# Altium schematic sheet STM32F429.SchDoc
size A2 portrait
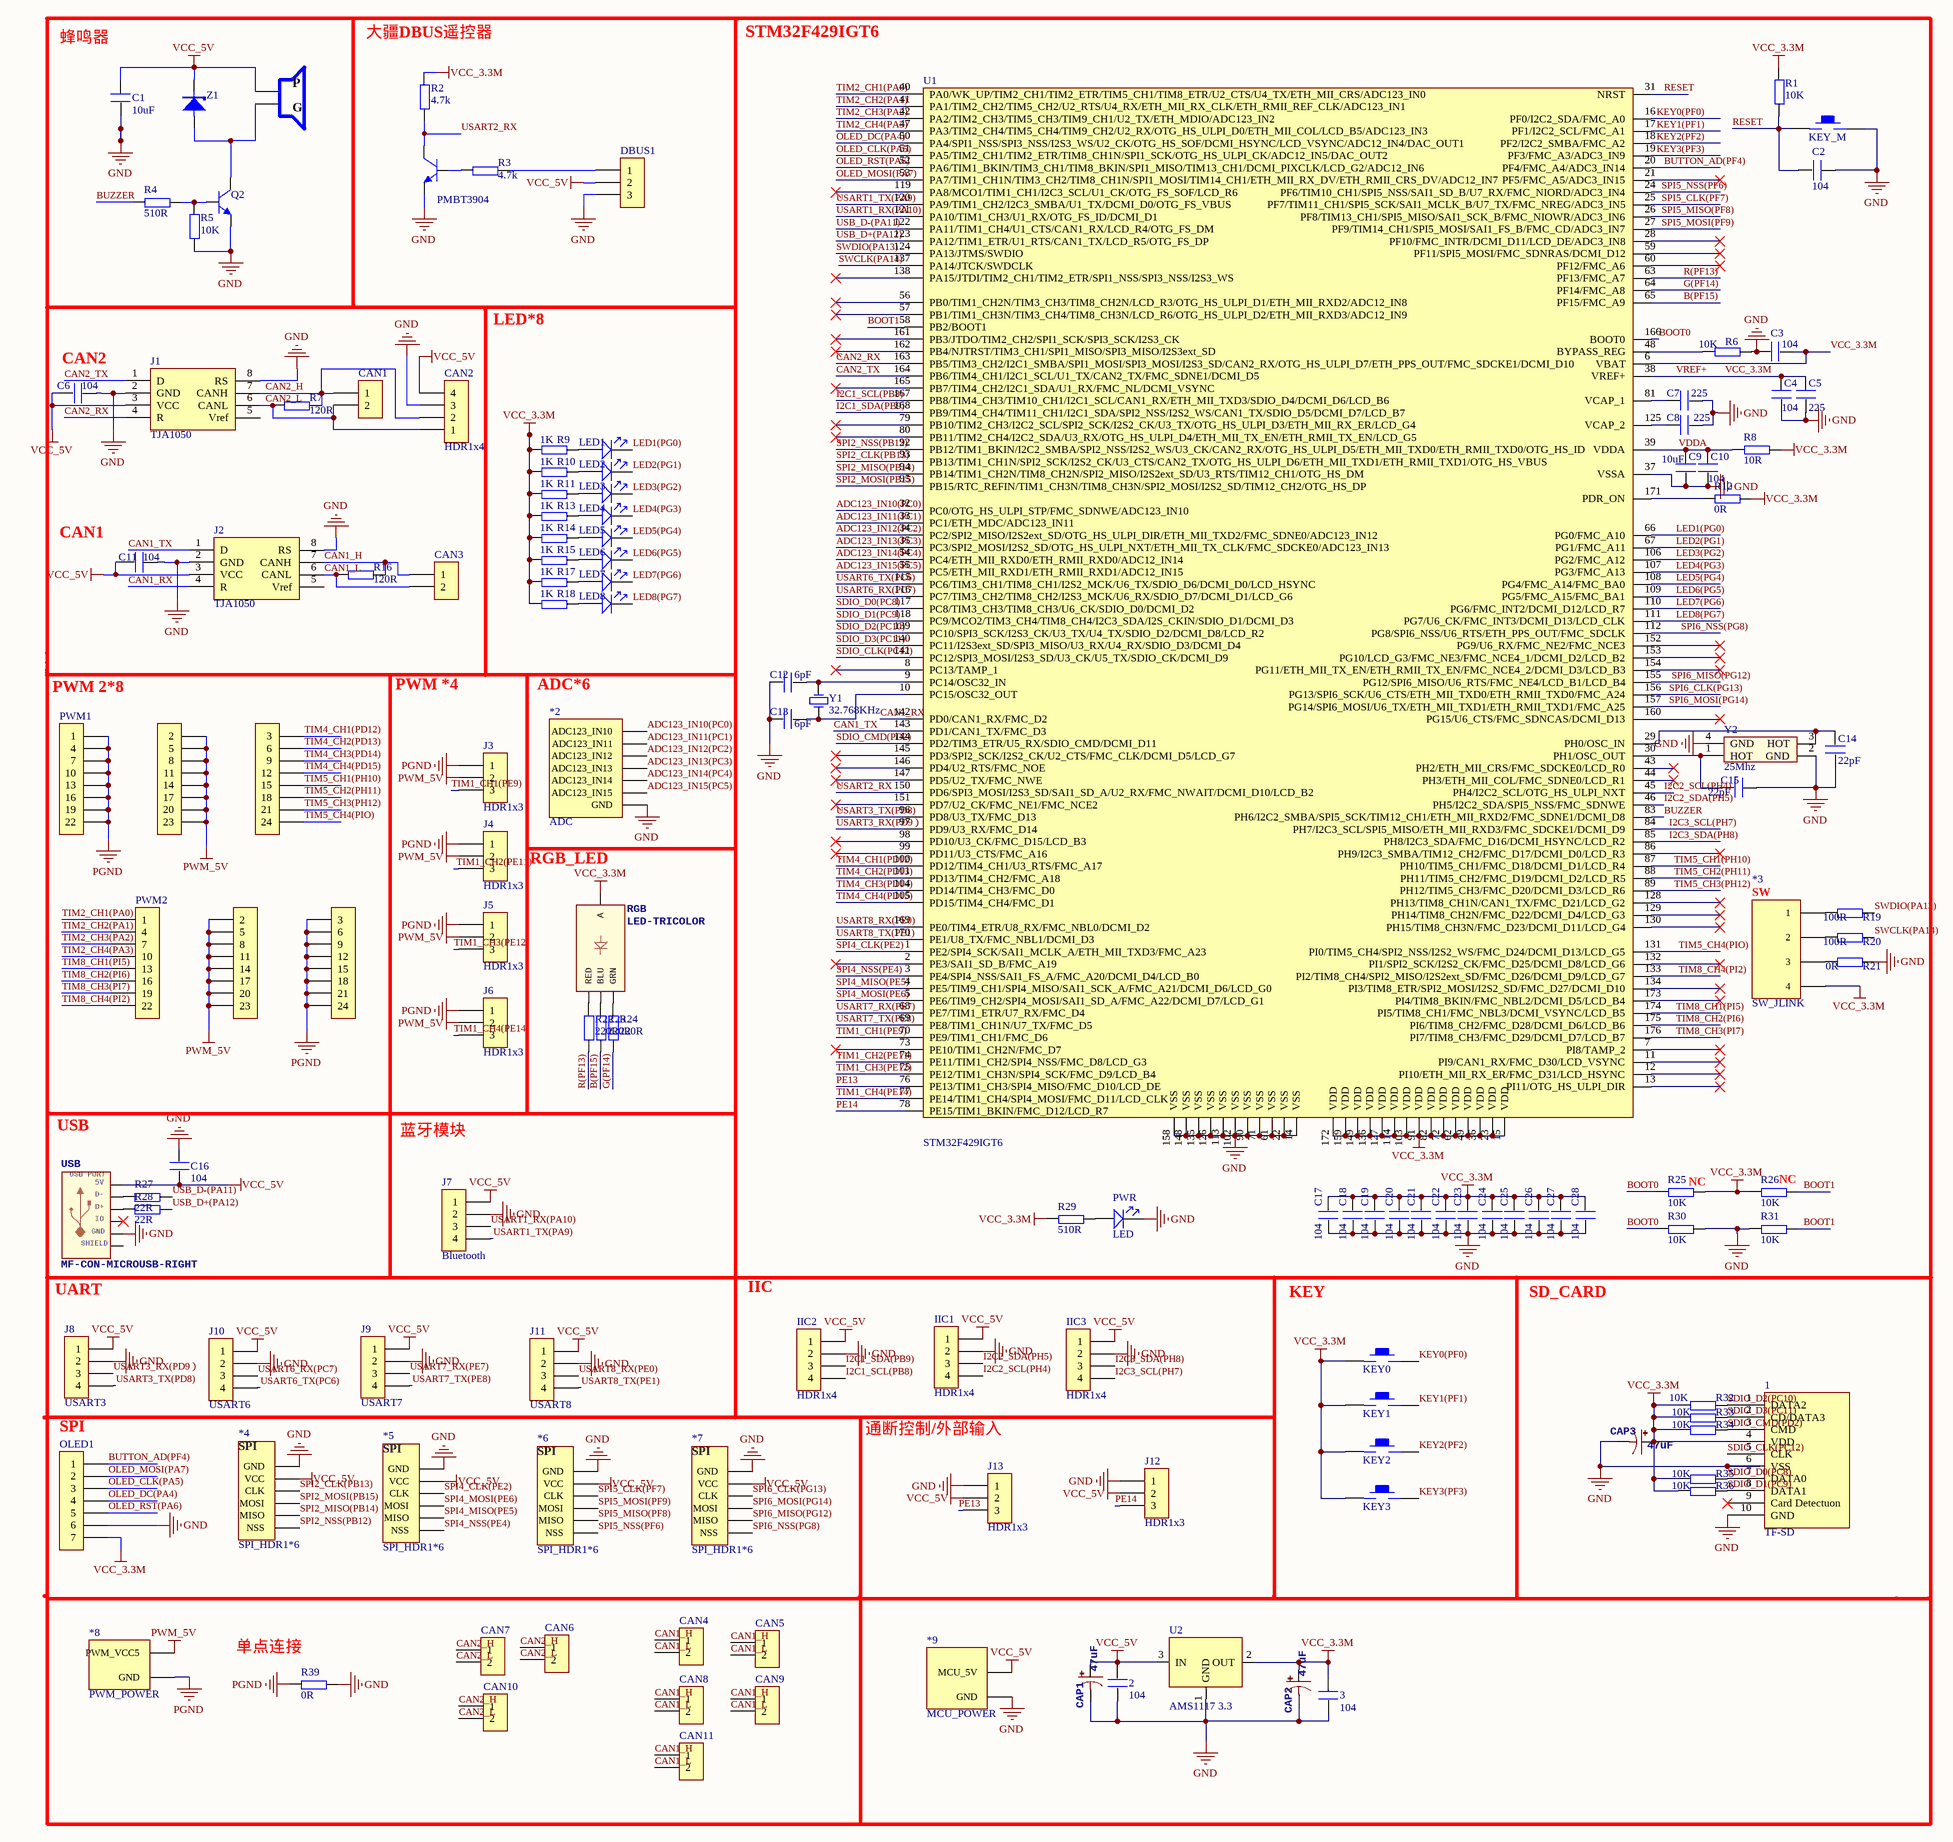
[diagram p0: STM32F429.SchDoc]

## Parts
1  TF-SD  [TF]
2  104  [0603P]
3  104  [0603P]
*1  BUZZER  [BUZZER]  (value not drawn)
*2  ADC  [ADC]
*3  SW_JLINK  [GH1.25-立贴-4P]
*4  SPI_HDR1*6  [GH1.25-立贴-6P]
*5  SPI_HDR1*6  [GH1.25-立贴-6P]
*6  SPI_HDR1*6  [GH1.25-立贴-6P]
*7  SPI_HDR1*6  [GH1.25-立贴-6P]
*8  PWM_POWER  [XT30_PW母头]
*9  MCU_POWER  [XT30_PW母头]
C1  10uF  [0603P]
C2  104  [0603P]
C3  104  [0603P]
C4  104  [0603P]
C5  225  [0603P]
C6  104  [0603P]
C7  225  [0603P]
C8  225  [0603P]
C9  10uF  [0603P]
C10  104  [0603P]
C11  104  [0603P]
C12  6pF  [0603P]
C13  6pF  [0603P]
C14  22pF  [0603P]
C15  22pF  [0603P]
C16  104  [0603P]
C17  104  [0603P]
C18  104  [0603P]
C19  104  [0603P]
C20  104  [0603P]
C21  104  [0603P]
C22  104  [0603P]
C23  104  [0603P]
C24  104  [0603P]
C25  104  [0603P]
C26  104  [0603P]
C27  104  [0603P]
C28  104  [0603P]
CAN1  HDR1x2-right  [GH1.25-立贴-2P]  (value not drawn)
CAN2  HDR1x4  [GH1.25-立贴-4P]
CAN3  HDR1x2-right  [GH1.25-立贴-2P]  (value not drawn)
CAN4  HDR1x2-right  [GH1.25-立贴-2P]  (value not drawn)
CAN5  HDR1x2-right  [GH1.25-立贴-2P]  (value not drawn)
CAN6  HDR1x2-right  [GH1.25-立贴-2P]  (value not drawn)
CAN7  HDR1x2-right  [GH1.25-立贴-2P]  (value not drawn)
CAN8  HDR1x2-right  [GH1.25-立贴-2P]  (value not drawn)
CAN9  HDR1x2-right  [GH1.25-立贴-2P]  (value not drawn)
CAN10  HDR1x2-right  [GH1.25-立贴-2P]  (value not drawn)
CAN11  HDR1x2-right  [GH1.25-立贴-2P]  (value not drawn)
CAP1  47uF  [EIA3216]
CAP2  47uF  [EIA3216]
CAP3  47uF  [EIA3216]
DBUS1  HDR1x3-right  [PIN-1*3-2.54]  (value not drawn)
IIC1  HDR1x4  [GH1.25-立贴-4P]
IIC2  HDR1x4  [GH1.25-立贴-4P]
IIC3  HDR1x4  [GH1.25-立贴-4P]
J1  TJA1050  [SOIC-8_150mil]
J2  TJA1050  [SOIC-8_150mil]
J3  HDR1x3  [HDR1X3]
J4  HDR1x3  [HDR1X3]
J5  HDR1x3  [HDR1X3]
J6  HDR1x3  [HDR1X3]
J7  Bluetooth  [1X04]
J8  USART3  [GH1.25-立贴-4P]
J9  USART7  [GH1.25-立贴-4P]
J10  USART6  [GH1.25-立贴-4P]
J11  USART8  [GH1.25-立贴-4P]
J12  HDR1x3  [HDR1X3]
J13  HDR1x3  [HDR1X3]
KEY1  KEY0  [KEY_SOP324225]
KEY2  KEY1  [KEY_SOP324225]
KEY3  KEY2  [KEY_SOP324225]
KEY4  KEY3  [KEY_SOP324225]
LED1  LED  [0805 LED]  (value not drawn)
LED2  LED  [0805 LED]  (value not drawn)
LED3  LED  [0805 LED]  (value not drawn)
LED4  LED  [0805 LED]  (value not drawn)
LED5  LED  [0805 LED]  (value not drawn)
LED6  LED  [0805 LED]  (value not drawn)
LED7  LED  [0805 LED]  (value not drawn)
LED8  LED  [0805 LED]  (value not drawn)
OLED1  HDR1x7-left  [GH1.25-立贴-7P]  (value not drawn)
PWM1  HDR3*8-right  [PIN-3*8-2.54 - duplicate]  (value not drawn)
PWM2  HDR3*8-left  [PIN-3*8-2.54 - duplicate]  (value not drawn)
PWR  LED  [0805 LED]
Q1  PMBT3904  [SOT-23-3]
Q2  S8050  [SOT-23-3]  (value not drawn)
R1  10K  [0603P]
R2  4.7k  [0603P]
R3  4.7k  [0603P]
R4  510R  [0603P]
R5  10K  [0603P]
R6  10K  [0603P]
R7  120R  [0603P]
R8  10R  [0603P]
R9  1K  [0603P]
R10  1K  [0603P]
R11  1K  [0603P]
R12  0R  [0603P]
R13  1K  [0603P]
R14  1K  [0603P]
R15  1K  [0603P]
R16  120R  [0603P]
R17  1K  [0603P]
R18  1K  [0603P]
R19  100R  [0603P]
R20  100R  [0603P]
R21  0R  [0603P]
R22  220R  [0603P]
R23  220R  [0603P]
R24  220R  [0603P]
R25  10K  [0603P]
R26  10K  [0603P]
R27  22R  [0603P]
R28  22R  [0603P]
R29  510R  [0603P]
R30  10K  [0603P]
R31  10K  [0603P]
R32  10K  [0603P]
R33  10K  [0603P]
R34  10K  [0603P]
R35  10K  [0603P]
R36  10K  [0603P]
R39  0R  [0805]
RGB  LED-TRICOLOR  [rgb]
RST1  KEY_M  [KEY_SOP324225]
U1  STM32F429IGT6  [LQFP176]
U2  AMS1117 3.3  [SOT_223]
USB  MF-CON-MICROUSB-RIGHT  USBPORT: USB PORT  [micro_usb]
Y1  32.768KHz  [XTAL3215]
Y2  25Mhz  [XTAL3225]
Z1  MMSZ4684  [SOD-123]  (value not drawn)

## Nets
GND: 1.6(VSS) 1.10(GND) 2.1 3.1 *2.6(GND) *4.1(GND) *5.1(GND) *6.1(GND) *7.1(GND) *9.2(GND) C1.1 C2.1 C3.1 C4.1 C5.1 C6.1 C7.2 C8.2 C9.1 C10.1 C11.1 C12.1 C13.1 C14.1 C15.1 C16.2 C17.1 C18.1 C19.1 C20.1 C21.1 C22.1 C23.1 C24.1 C25.1 C26.1 C27.1 C28.1 CAN2.3 CAP1.C(-) CAP2.C(-) CAP3.C(-) DBUS1.3 IIC1.2 IIC2.2 IIC3.2 J1.2(GND) J1.8(RS) J2.2(GND) J2.8(RS) J7.2 J8.2 J9.2 J10.2 J11.2 J12.1 J13.1 OLED1.6 PWR.2 Q1.2(E) Q2.2(E) R5.1 R6.2 R21.2 R30.2 R31.1 R39.2 RST1.2 U1.14(VSS) U1.22(VSS) U1.37(VSSA) U1.61(VSS) U1.71(VSS) U1.90(VSS) U1.102(VSS) U1.113(VSS) U1.126(VSS) U1.135(VSS) U1.148(VSS) U1.158(VSS) U2.1(GND) USB.5(GND) Y2.2(GND) Y2.4(GND)
PGND: *8.2(GND) J3.1 J4.1 J5.1 J6.1 PWM1.1 PWM1.4 PWM1.7 PWM1.10 PWM1.13 PWM1.16 PWM1.19 PWM1.22 PWM2.3 PWM2.6 PWM2.9 PWM2.12 PWM2.15 PWM2.18 PWM2.21 PWM2.24 R39.1
PWM_5V: *8.1(PWM_VCC5) J3.2 J4.2 J5.2 J6.2 PWM1.2 PWM1.5 PWM1.8 PWM1.11 PWM1.14 PWM1.17 PWM1.20 PWM1.23 PWM2.2 PWM2.5 PWM2.8 PWM2.11 PWM2.14 PWM2.17 PWM2.20 PWM2.23
VCC_3.3M: 1.4(VDD) 3.2 *3.4 C3.2 C4.2 C5.2 C17.2 C18.2 C19.2 C20.2 C21.2 C22.2 C23.2 C24.2 C25.2 C26.2 C27.2 C28.2 CAP2.A(+) CAP3.A(+) KEY1.1 KEY2.1 KEY3.1 KEY4.1 OLED1.7 R1.2 R2.2 R8.2 R9.1 R10.1 R11.1 R12.2 R13.1 R14.1 R15.1 R17.1 R18.1 R25.2 R26.1 R29.1 R32.1 R33.1 R34.1 R35.1 R36.1 RGB.A U1.6(VBAT) U1.15(VDD) U1.23(VDD) U1.36(VDD) U1.38(VREF+) U1.49(VDD) U1.62(VDD) U1.72(VDD) U1.82(VDD) U1.91(VDD) U1.103(VDD) U1.114(VDD) U1.127(VDD) U1.136(VDD) U1.149(VDD) U1.159(VDD) U1.172(VDD) U2.2(OUT)  [also labelled VREF+]
VCC_5V: 2.2 *1.1 *4.2(VCC) *5.2(VCC) *6.2(VCC) *7.2(VCC) *9.1(MCU_5V) C1.2 C6.2 C11.2 C16.1 CAN2.4 CAP1.A(+) DBUS1.2 IIC1.1 IIC2.1 IIC3.1 J1.3(VCC) J2.3(VCC) J7.1 J8.1 J9.1 J10.1 J11.1 J12.2 J13.2 U2.3(IN) USB.1(5V) Z1.2(C)
ADC123_IN10(PC0): *2.0(ADC123_IN10) U1.32(PC0/OTG_HS_ULPI_STP/FMC_SDNWE/ADC123_IN10)
ADC123_IN11(PC1): *2.1(ADC123_IN11) U1.33(PC1/ETH_MDC/ADC123_IN11)
ADC123_IN12(PC2): *2.2(ADC123_IN12) U1.34(PC2/SPI2_MISO/I2S2ext_SD/OTG_HS_ULPI_DIR/ETH_MII_TXD2/FMC_SDNE0/ADC123_IN12)
ADC123_IN13(PC3): *2.3(ADC123_IN13) U1.35(PC3/SPI2_MOSI/I2S2_SD/OTG_HS_ULPI_NXT/ETH_MII_TX_CLK/FMC_SDCKE0/ADC123_IN13)
ADC123_IN14(PC4): *2.4(ADC123_IN14) U1.54(PC4/ETH_MII_RXD0/ETH_RMII_RXD0/ADC12_IN14)
ADC123_IN15(PC5): *2.5(ADC123_IN15) U1.55(PC5/ETH_MII_RXD1/ETH_RMII_RXD1/ADC12_IN15)
B(PF15): R23.1 U1.65(PF15/FMC_A9)
BOOT0: R25.1 R30.1 U1.166(BOOT0)
BOOT1: R26.2 R31.2 U1.58(PB2/BOOT1)
BUTTON_AD(PF4): OLED1.1 U1.20(PF4/FMC_A4/ADC3_IN14)
BUZZER: R4.1 U1.83(PH6/I2C2_SMBA/SPI5_SCK/TIM12_CH1/ETH_MII_RXD2/FMC_SDNE1/DCMI_D8)
CAN1_H: CAN3.1 CAN4.1 CAN5.1 CAN8.1 CAN9.1 CAN11.1 J2.7(CANH) R16.2
CAN1_L: CAN3.2 CAN4.2 CAN5.2 CAN8.2 CAN9.2 CAN11.2 J2.6(CANL) R16.1
CAN1_RX: J2.4(R) U1.142(PD0/CAN1_RX/FMC_D2)
CAN1_TX: J2.1(D) U1.143(PD1/CAN1_TX/FMC_D3)
CAN2_H: CAN1.1 CAN2.2 CAN6.1 CAN7.1 CAN10.1 J1.7(CANH) R7.2
CAN2_L: CAN1.2 CAN2.1 CAN6.2 CAN7.2 CAN10.2 J1.6(CANL) R7.1
CAN2_RX: J1.4(R) U1.163(PB5/TIM3_CH2/I2C1_SMBA/SPI1_MOSI/SPI3_MOSI/I2S3_SD/CAN2_RX/OTG_HS_ULPI_D7/ETH_PPS_OUT/FMC_SDCKE1/DCMI_D10)
CAN2_TX: J1.1(D) U1.164(PB6/TIM4_CH1/I2C1_SCL/U1_TX/CAN2_TX/FMC_SDNE1/DCMI_D5)
G(PF14): R24.1 U1.64(PF14/FMC_A8)
I2C1_SCL(PB8): IIC2.4 U1.167(PB8/TIM4_CH3/TIM10_CH1/I2C1_SCL/CAN1_RX/ETH_MII_TXD3/SDIO_D4/DCMI_D6/LCD_B6)
I2C1_SDA(PB9): IIC2.3 U1.168(PB9/TIM4_CH4/TIM11_CH1/I2C1_SDA/SPI2_NSS/I2S2_WS/CAN1_TX/SDIO_D5/DCMI_D7/LCD_B7)
I2C2_SCL(PH4): IIC1.4 U1.45(PH4/I2C2_SCL/OTG_HS_ULPI_NXT)
I2C2_SDA(PH5): IIC1.3 U1.46(PH5/I2C2_SDA/SPI5_NSS/FMC_SDNWE)
I2C3_SCL(PH7): IIC3.4 U1.84(PH7/I2C3_SCL/SPI5_MISO/ETH_MII_RXD3/FMC_SDCKE1/DCMI_D9)
I2C3_SDA(PH8): IIC3.3 U1.85(PH8/I2C3_SDA/FMC_D16/DCMI_HSYNC/LCD_R2)
KEY0(PF0): KEY1.2 U1.16(PF0/I2C2_SDA/FMC_A0)
KEY1(PF1): KEY2.2 U1.17(PF1/I2C2_SCL/FMC_A1)
KEY2(PF2): KEY3.2 U1.18(PF2/I2C2_SMBA/FMC_A2)
KEY3(PF3): KEY4.2 U1.19(PF3/FMC_A3/ADC3_IN9)
LED1(PG0): LED1.2 U1.66(PG0/FMC_A10)
LED2(PG1): LED2.2 U1.67(PG1/FMC_A11)
LED3(PG2): LED3.2 U1.106(PG2/FMC_A12)
LED4(PG3): LED4.2 U1.107(PG3/FMC_A13)
LED5(PG4): LED5.2 U1.108(PG4/FMC_A14/FMC_BA0)
LED6(PG5): LED6.2 U1.109(PG5/FMC_A15/FMC_BA1)
LED7(PG6): LED7.2 U1.110(PG6/FMC_INT2/DCMI_D12/LCD_R7)
LED8(PG7): LED8.2 U1.111(PG7/U6_CK/FMC_INT3/DCMI_D13/LCD_CLK)
OLED_CLK(PA5): OLED1.3 U1.51(PA5/TIM2_CH1/TIM2_ETR/TIM8_CH1N/SPI1_SCK/OTG_HS_ULPI_CK/ADC12_IN5/DAC_OUT2)
OLED_DC(PA4): OLED1.4 U1.50(PA4/SPI1_NSS/SPI3_NSS/I2S3_WS/U2_CK/OTG_HS_SOF/DCMI_HSYNC/LCD_VSYNC/ADC12_IN4/DAC_OUT1)
OLED_MOSI(PA7): OLED1.2 U1.53(PA7/TIM1_CH1N/TIM3_CH2/TIM8_CH1N/SPI1_MOSI/TIM14_CH1/ETH_MII_RX_DV/ETH_RMII_CRS_DV/ADC12_IN7)
OLED_RST(PA6): OLED1.5 U1.52(PA6/TIM1_BKIN/TIM3_CH1/TIM8_BKIN/SPI1_MISO/TIM13_CH1/DCMI_PIXCLK/LCD_G2/ADC12_IN6)
PE13: J13.3 U1.76(PE13/TIM1_CH3/SPI4_MISO/FMC_D10/LCD_DE)
PE14: J12.3 U1.78(PE15/TIM1_BKIN/FMC_D12/LCD_R7)
R(PF13): R22.1 U1.63(PF13/FMC_A7)
RESET: C2.2 R1.1 RST1.1 U1.31(NRST)
SDIO_CLK(PC12): 1.5(CLK) U1.141(PC12/SPI3_MOSI/I2S3_SD/U3_CK/U5_TX/SDIO_CK/DCMI_D9)
SDIO_CMD(PD2): 1.3(CMD) R34.2 U1.144(PD2/TIM3_ETR/U5_RX/SDIO_CMD/DCMI_D11)
SDIO_D0(PC8): 1.7(DATA0) R35.2 U1.117(PC8/TIM3_CH3/TIM8_CH3/U6_CK/SDIO_D0/DCMI_D2)
SDIO_D1(PC9): 1.8(DATA1) R36.2 U1.118(PC9/MCO2/TIM3_CH4/TIM8_CH4/I2C3_SDA/I2S_CKIN/SDIO_D1/DCMI_D3)
SDIO_D2(PC10): 1.1(DATA2) R32.2 U1.139(PC10/SPI3_SCK/I2S3_CK/U3_TX/U4_TX/SDIO_D2/DCMI_D8/LCD_R2)
SDIO_D3(PC11): 1.2(CD/DATA3) R33.2 U1.140(PC11/I2S3ext_SD/SPI3_MISO/U3_RX/U4_RX/SDIO_D3/DCMI_D4)
SPI2_CLK(PB13): *4.3(CLK) U1.93(PB13/TIM1_CH1N/SPI2_SCK/I2S2_CK/U3_CTS/CAN2_TX/OTG_HS_ULPI_D6/ETH_MII_TXD1/ETH_RMII_TXD1/OTG_HS_VBUS)
SPI2_MISO(PB14): *4.5(MISO) U1.94(PB14/TIM1_CH2N/TIM8_CH2N/SPI2_MISO/I2S2ext_SD/U3_RTS/TIM12_CH1/OTG_HS_DM)
SPI2_MOSI(PB15): *4.4(MOSI) U1.95(PB15/RTC_REFIN/TIM1_CH3N/TIM8_CH3N/SPI2_MOSI/I2S2_SD/TIM12_CH2/OTG_HS_DP)
SPI2_NSS(PB12): *4.6(NSS) U1.92(PB12/TIM1_BKIN/I2C2_SMBA/SPI2_NSS/I2S2_WS/U3_CK/CAN2_RX/OTG_HS_ULPI_D5/ETH_MII_TXD0/ETH_RMII_TXD0/OTG_HS_ID)
SPI4_CLK(PE2): *5.3(CLK) U1.1(PE2/SPI4_SCK/SAI1_MCLK_A/ETH_MII_TXD3/FMC_A23)
SPI4_MISO(PE5): *5.5(MISO) U1.4(PE5/TIM9_CH1/SPI4_MISO/SAI1_SCK_A/FMC_A21/DCMI_D6/LCD_G0)
SPI4_MOSI(PE6): *5.4(MOSI) U1.5(PE6/TIM9_CH2/SPI4_MOSI/SAI1_SD_A/FMC_A22/DCMI_D7/LCD_G1)
SPI4_NSS(PE4): *5.6(NSS) U1.3(PE4/SPI4_NSS/SAI1_FS_A/FMC_A20/DCMI_D4/LCD_B0)
SPI5_CLK(PF7): *6.3(CLK) U1.25(PF7/TIM11_CH1/SPI5_SCK/SAI1_MCLK_B/U7_TX/FMC_NREG/ADC3_IN5)
SPI5_MISO(PF8): *6.5(MISO) U1.26(PF8/TIM13_CH1/SPI5_MISO/SAI1_SCK_B/FMC_NIOWR/ADC3_IN6)
SPI5_MOSI(PF9): *6.4(MOSI) U1.27(PF9/TIM14_CH1/SPI5_MOSI/SAI1_FS_B/FMC_CD/ADC3_IN7)
SPI5_NSS(PF6): *6.6(NSS) U1.24(PF6/TIM10_CH1/SPI5_NSS/SAI1_SD_B/U7_RX/FMC_NIORD/ADC3_IN4)
SPI6_CLK(PG13): *7.3(CLK) U1.156(PG13/SPI6_SCK/U6_CTS/ETH_MII_TXD0/ETH_RMII_TXD0/FMC_A24)
SPI6_MISO(PG12): *7.5(MISO) U1.155(PG12/SPI6_MISO/U6_RTS/FMC_NE4/LCD_B1/LCD_B4)
SPI6_MOSI(PG14): *7.4(MOSI) U1.157(PG14/SPI6_MOSI/U6_TX/ETH_MII_TXD1/ETH_RMII_TXD1/FMC_A25)
SPI6_NSS(PG8): *7.6(NSS) U1.112(PG8/SPI6_NSS/U6_RTS/ETH_PPS_OUT/FMC_SDCLK)
SWCLK(PA14): R20.2 U1.137(PA14/JTCK/SWDCLK)
SWDIO(PA13): R19.2 U1.124(PA13/JTMS/SWDIO)
TIM1_CH1(PE9): J3.3 U1.70(PE9/TIM1_CH1/FMC_D6)
TIM1_CH2(PE11): J4.3 U1.74(PE11/TIM1_CH2/SPI4_NSS/FMC_D8/LCD_G3)
TIM1_CH3(PE12): J5.3 U1.75(PE12/TIM1_CH3N/SPI4_SCK/FMC_D9/LCD_B4)
TIM1_CH4(PE14): J6.3 U1.77(PE14/TIM1_CH4/SPI4_MOSI/FMC_D11/LCD_CLK)
TIM2_CH1(PA0): PWM2.1 U1.40(PA0/WK_UP/TIM2_CH1/TIM2_ETR/TIM5_CH1/TIM8_ETR/U2_CTS/U4_TX/ETH_MII_CRS/ADC123_IN0)
TIM2_CH2(PA1): PWM2.4 U1.41(PA1/TIM2_CH2/TIM5_CH2/U2_RTS/U4_RX/ETH_MII_RX_CLK/ETH_RMII_REF_CLK/ADC123_IN1)
TIM2_CH3(PA2): PWM2.7 U1.42(PA2/TIM2_CH3/TIM5_CH3/TIM9_CH1/U2_TX/ETH_MDIO/ADC123_IN2)
TIM2_CH4(PA3): PWM2.10 U1.47(PA3/TIM2_CH4/TIM5_CH4/TIM9_CH2/U2_RX/OTG_HS_ULPI_D0/ETH_MII_COL/LCD_B5/ADC123_IN3)
TIM4_CH1(PD12): PWM1.3 U1.100(PD12/TIM4_CH1/U3_RTS/FMC_A17)
TIM4_CH2(PD13): PWM1.6 U1.101(PD13/TIM4_CH2/FMC_A18)
TIM4_CH3(PD14): PWM1.9 U1.104(PD14/TIM4_CH3/FMC_D0)
TIM4_CH4(PD15): PWM1.12 U1.105(PD15/TIM4_CH4/FMC_D1)
TIM5_CH1(PH10): PWM1.15 U1.87(PH10/TIM5_CH1/FMC_D18/DCMI_D1/LCD_R4)
TIM5_CH2(PH11): PWM1.18 U1.88(PH11/TIM5_CH2/FMC_D19/DCMI_D2/LCD_R5)
TIM5_CH3(PH12): PWM1.21 U1.89(PH12/TIM5_CH3/FMC_D20/DCMI_D3/LCD_R6)
TIM5_CH4(PIO): PWM1.24 U1.131(PI0/TIM5_CH4/SPI2_NSS/I2S2_WS/FMC_D24/DCMI_D13/LCD_G5)
TIM8_CH1(PI5): PWM2.13 U1.174(PI5/TIM8_CH1/FMC_NBL3/DCMI_VSYNC/LCD_B5)
TIM8_CH2(PI6): PWM2.16 U1.175(PI6/TIM8_CH2/FMC_D28/DCMI_D6/LCD_B6)
TIM8_CH3(PI7): PWM2.19 U1.176(PI7/TIM8_CH3/FMC_D29/DCMI_D7/LCD_B7)
TIM8_CH4(PI2): PWM2.22 U1.133(PI2/TIM8_CH4/SPI2_MISO/I2S2ext_SD/FMC_D26/DCMI_D9/LCD_G7)
USART1_RX(PA10): J7.3 U1.121(PA10/TIM1_CH3/U1_RX/OTG_FS_ID/DCMI_D1)
USART1_TX(PA9): J7.4 U1.120(PA9/TIM1_CH2/I2C3_SMBA/U1_TX/DCMI_D0/OTG_FS_VBUS)
USART2_RX: Q1.3(C) R2.1 U1.150(PD6/SPI3_MOSI/I2S3_SD/SAI1_SD_A/U2_RX/FMC_NWAIT/DCMI_D10/LCD_B2)
USART3_RX(PD9）: J8.3 U1.97(PD9/U3_RX/FMC_D14)
USART3_TX(PD8): J8.4 U1.96(PD8/U3_TX/FMC_D13)
USART6_RX(PC7): J10.3 U1.116(PC7/TIM3_CH2/TIM8_CH2/I2S3_MCK/U6_RX/SDIO_D7/DCMI_D1/LCD_G6)
USART6_TX(PC6): J10.4 U1.115(PC6/TIM3_CH1/TIM8_CH1/I2S2_MCK/U6_TX/SDIO_D6/DCMI_D0/LCD_HSYNC)
USART7_RX(PE7): J9.3 U1.68(PE7/TIM1_ETR/U7_RX/FMC_D4)
USART7_TX(PE8): J9.4 U1.69(PE8/TIM1_CH1N/U7_TX/FMC_D5)
USART8_RX(PE0): J11.3 U1.169(PE0/TIM4_ETR/U8_RX/FMC_NBL0/DCMI_D2)
USART8_TX(PE1): J11.4 U1.170(PE1/U8_TX/FMC_NBL1/DCMI_D3)
USB_D+(PA12): R28.2 U1.123(PA12/TIM1_ETR/U1_RTS/CAN1_TX/LCD_R5/OTG_FS_DP)
USB_D-(PA11): R27.2 U1.122(PA11/TIM1_CH4/U1_CTS/CAN1_RX/LCD_R4/OTG_FS_DM)
VDDA: C9.2 C10.2 R8.1 U1.39(VDDA)
Net*1_2: *1.2 Q2.3(C) Z1.1(A)
Net*3_1: *3.1 R19.1
Net*3_2: *3.2 R20.1
Net*3_3: *3.3 R21.1
NetC7_1: C7.1 U1.81(VCAP_1)
NetC8_1: C8.1 U1.125(VCAP_2)
NetC12_2: C12.2 U1.9(PC14/OSC32_IN) Y1.2(OSC2)
NetC13_2: C13.2 U1.10(PC15/OSC32_OUT) Y1.1(OSC1)
NetC14_2: C14.2 U1.29(PH0/OSC_IN) Y2.3(HOT)
NetC15_2: C15.2 U1.30(PH1/OSC_OUT) Y2.1(HOT)
NetDBUS1_1: DBUS1.1 R3.2
NetLED1_1: LED1.1 R9.2
NetLED2_1: LED2.1 R10.2
NetLED3_1: LED3.1 R11.2
NetLED4_1: LED4.1 R13.2
NetLED5_1: LED5.1 R14.2
NetLED6_1: LED6.1 R15.2
NetLED7_1: LED7.1 R17.2
NetLED8_1: LED8.1 R18.2
NetPWR_1: PWR.1 R29.2
NetQ1_1: Q1.1(B) R3.1
NetQ2_1: Q2.1(B) R4.2 R5.2
NetR6_1: R6.1 U1.48(BYPASS_REG)
NetR12_1: R12.1 U1.171(PDR_ON)
NetR22_2: R22.2 RGB.R(RED)
NetR23_2: R23.2 RGB.B(BLU)
NetR24_2: R24.2 RGB.G(GRN)
NetR27_1: R27.1 USB.2(D-)
NetR28_1: R28.1 USB.3(D+)

Not connected (* = marked no-connect by the designer): 1 9(Card_Detectuon)*; J1 5(Vref); J2 5(Vref); U1 2(PE3/SAI1_SD_B/FMC_A19)* 7(PI8/TAMP_2)* 8(PC13/TAMP_1)* 11(PI9/CAN1_RX/FMC_D30/LCD_VSYNC)* 12(PI10/ETH_MII_RX_ER/FMC_D31/LCD_HSYNC)* 13(PI11/OTG_HS_ULPI_DIR)* 21(PF5/FMC_A5/ADC3_IN15)* 28(PF10/FMC_INTR/DCMI_D11/LCD_DE/ADC3_IN8)* 43(PH2/ETH_MII_CRS/FMC_SDCKE0/LCD_R0)* 44(PH3/ETH_MII_COL/FMC_SDNE0/LCD_R1)* 56(PB0/TIM1_CH2N/TIM3_CH3/TIM8_CH2N/LCD_R3/OTG_HS_ULPI_D1/ETH_MII_RXD2/ADC12_IN8)* 57(PB1/TIM1_CH3N/TIM3_CH4/TIM8_CH3N/LCD_R6/OTG_HS_ULPI_D2/ETH_MII_RXD3/ADC12_IN9)* 59(PF11/SPI5_MOSI/FMC_SDNRAS/DCMI_D12)* 60(PF12/FMC_A6)* 73(PE10/TIM1_CH2N/FMC_D7)* 79(PB10/TIM2_CH3/I2C2_SCL/SPI2_SCK/I2S2_CK/U3_TX/OTG_HS_ULPI_D3/ETH_MII_RX_ER/LCD_G4)* 80(PB11/TIM2_CH4/I2C2_SDA/U3_RX/OTG_HS_ULPI_D4/ETH_MII_TX_EN/ETH_RMII_TX_EN/LCD_G5)* 86(PH9/I2C3_SMBA/TIM12_CH2/FMC_D17/DCMI_D0/LCD_R3)* 98(PD10/U3_CK/FMC_D15/LCD_B3)* 99(PD11/U3_CTS/FMC_A16)* 119(PA8/MCO1/TIM1_CH1/I2C3_SCL/U1_CK/OTG_FS_SOF/LCD_R6)* 128(PH13/TIM8_CH1N/CAN1_TX/FMC_D21/LCD_G2)* 129(PH14/TIM8_CH2N/FMC_D22/DCMI_D4/LCD_G3)* 130(PH15/TIM8_CH3N/FMC_D23/DCMI_D11/LCD_G4)* 132(PI1/SPI2_SCK/I2S2_CK/FMC_D25/DCMI_D8/LCD_G6)* 134(PI3/TIM8_ETR/SPI2_MOSI/I2S2_SD/FMC_D27/DCMI_D10)* 138(PA15/JTDI/TIM2_CH1/TIM2_ETR/SPI1_NSS/SPI3_NSS/I2S3_WS)* 145(PD3/SPI2_SCK/I2S2_CK/U2_CTS/FMC_CLK/DCMI_D5/LCD_G7)* 146(PD4/U2_RTS/FMC_NOE)* 147(PD5/U2_TX/FMC_NWE)* 151(PD7/U2_CK/FMC_NE1/FMC_NCE2)* 152(PG9/U6_RX/FMC_NE2/FMC_NCE3)* 153(PG10/LCD_G3/FMC_NE3/FMC_NCE4_1/DCMI_D2/LCD_B2)* 154(PG11/ETH_MII_TX_EN/ETH_RMII_TX_EN/FMC_NCE4_2/DCMI_D3/LCD_B3)* 160(PG15/U6_CTS/FMC_SDNCAS/DCMI_D13)* 161(PB3/JTDO/TIM2_CH2/SPI1_SCK/SPI3_SCK/I2S3_CK)* 162(PB4/NJTRST/TIM3_CH1/SPI1_MISO/SPI3_MISO/I2S3ext_SD)* 165(PB7/TIM4_CH2/I2C1_SDA/U1_RX/FMC_NL/DCMI_VSYNC)* 173(PI4/TIM8_BKIN/FMC_NBL2/DCMI_D5/LCD_B4)*; USB 4(ID)* S1 S2 S3 S4 S5 S6(SLD)

## Notes on the sheet
- 蜂鸣器
- (near R2) 大疆DBUS遥控器
- STM32F429IGT6
- LED*8
- (near C6) CAN2
- (near C11) CAN1
- (near PWM1) PWM 2*8
- PWM *4
- ADC*6
- RGB_LED
- USB
- 蓝牙模块
- (near R25) NC
- (near R26) NC
- UART
- IIC
- KEY
- SD_CARD
- SPI
- 通断控制/外部输入
- (near R39) 单点连接
- Title
- Size:
- Date:
- File:
- A2
- Number:
- Time:
- Revision:
- Sheet
- of
- (in symbol BUZZER) P; G
- (in symbol SPI_HDR1*6) SPI
- (in symbol SW_JLINK) SW

## Library data of the parts
2 3 C1-C28 = C
CAN1 CAN3-CAN11 = HDR1x2-right: Connector
CAN2 IIC1-IIC3 J7-J11 = HDR1x4: Connector
CAP1-CAP3 = CAP_POL1206: Capacitor PolarizedThese are standard SMD and PTH capacitors. Normally 10uF, 47uF, and 100uF in electrolytic and tantalum varieties. Always verify the external diameter of the through hole cap, it varies with capacity, voltage, and manufacturer. The EIA devices should be standard.
DBUS1 = HDR1x3-right: Connector
J1 J2 = TJA1050: CAN芯片
J3-J6 J12 J13 = HDR1x3: Connector
KEY1-KEY4 = KEY_M
OLED1 = HDR1x7-left: Connector
PWM1 = HDR3*8-right: Connector
PWM2 = HDR3*8-left: Connector
Q1 = PMBT3904: NPN Bipolar Transistor
Q2 = BJT: NPN Bipolar Transistor
R1 R6 R8-R15 R17-R36 R39 = R
R2-R5 R7 R16 = RES: Resistance
RGB = LED-TRICOLOR: Tri-Color LED SMDProven layout and schematic for triple color LED in SMD package - common anode. Spark Fun Electronics SKU : COM-07844
U2 = AMS1117
USB = USB_MICRO_RIGHT: Library:  MF_Connectors Description: 5 Pin USB Connectors. SLD is the shield connection. Usually tied to ground through a small ferrite bead.; 5V: 5V; D-: D-; D+: D+; ID: ID; GND: GND; SHIELD: SHIELD
Y1 = XTAL: 普通晶振; Published: 8-Jun-2000; LatestRevisionDate: 17-Jul-2002; LatestRevisionNote: Re-released for DXP Platform.; Publisher: Altium Limited
Y2 = XTAL_3225: 3225贴片无源晶振
Z1 = Diode: Zener Diode